# Altium schematic sheet CPU3.schdoc
size B; SheetNumber: 3; SheetTotal: 8
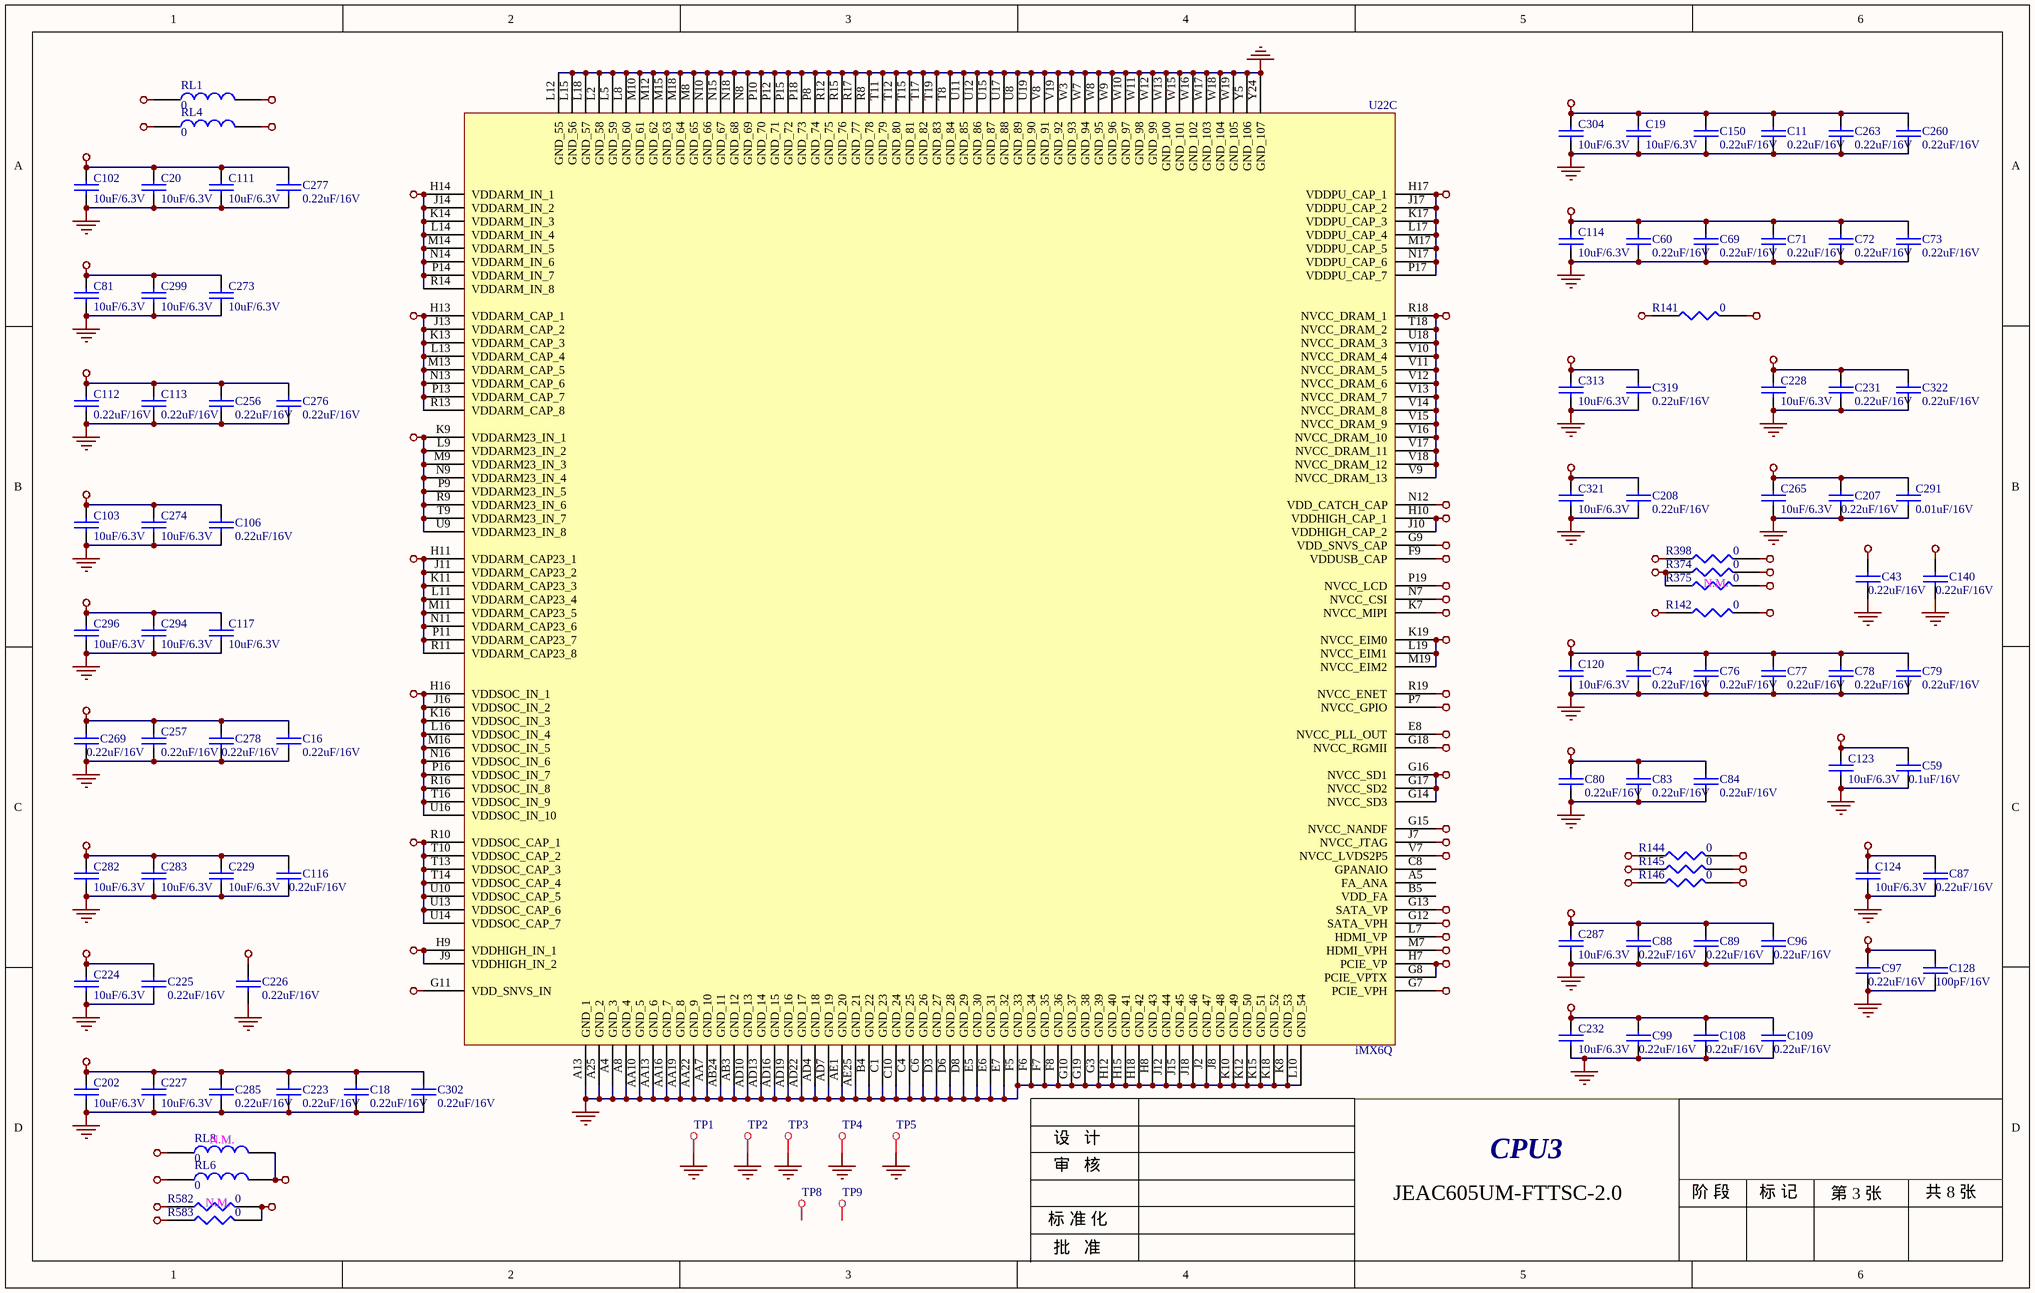
[diagram p0: CPU3.schdoc]

## Parts
C11  0.22uF/16V  [C0402]
C16  0.22uF/16V  [C0402]
C18  0.22uF/16V  [C0402]
C19  10uF/6.3V  [C0603]
C20  10uF/6.3V  [C0603]
C43  0.22uF/16V  [C0402]
C59  0.1uF/16V  [C0402]
C60  0.22uF/16V  [C0402]
C69  0.22uF/16V  [C0402]
C71  0.22uF/16V  [C0402]
C72  0.22uF/16V  [C0402]
C73  0.22uF/16V  [C0402]
C74  0.22uF/16V  [C0402]
C76  0.22uF/16V  [C0402]
C77  0.22uF/16V  [C0402]
C78  0.22uF/16V  [C0402]
C79  0.22uF/16V  [C0402]
C80  0.22uF/16V  [C0402]
C81  10uF/6.3V  [C0603]
C83  0.22uF/16V  [C0402]
C84  0.22uF/16V  [C0402]
C87  0.22uF/16V  [C0402]
C88  0.22uF/16V  [C0402]
C89  0.22uF/16V  [C0402]
C96  0.22uF/16V  [C0402]
C97  0.22uF/16V  [C0402]
C99  0.22uF/16V  [C0402]
C102  10uF/6.3V  [C0603]
C103  10uF/6.3V  [C0603]
C106  0.22uF/16V  [C0402]
C108  0.22uF/16V  [C0402]
C109  0.22uF/16V  [C0402]
C111  10uF/6.3V  [C0603]
C112  0.22uF/16V  [C0402]
C113  0.22uF/16V  [C0402]
C114  10uF/6.3V  [C0603]
C116  0.22uF/16V  [C0402]
C117  10uF/6.3V  [C0603]
C120  10uF/6.3V  [C0603]
C123  10uF/6.3V  [C0603]
C124  10uF/6.3V  [C0603]
C128  100pF/16V  [C0402]
C140  0.22uF/16V  [C0402]
C150  0.22uF/16V  [C0402]
C202  10uF/6.3V  [C0603]
C207  0.22uF/16V  [C0402]
C208  0.22uF/16V  [C0402]
C223  0.22uF/16V  [C0402]
C224  10uF/6.3V  [C0603]
C225  0.22uF/16V  [C0402]
C226  0.22uF/16V  [C0402]
C227  10uF/6.3V  [C0603]
C228  10uF/6.3V  [C0603]
C229  10uF/6.3V  [C0603]
C231  0.22uF/16V  [C0402]
C232  10uF/6.3V  [C0603]
C256  0.22uF/16V  [C0402]
C257  0.22uF/16V  [C0402]
C260  0.22uF/16V  [C0402]
C263  0.22uF/16V  [C0402]
C265  10uF/6.3V  [C0603]
C269  0.22uF/16V  [C0402]
C273  10uF/6.3V  [C0603]
C274  10uF/6.3V  [C0603]
C276  0.22uF/16V  [C0402]
C277  0.22uF/16V  [C0402]
C278  0.22uF/16V  [C0402]
C282  10uF/6.3V  [C0603]
C283  10uF/6.3V  [C0603]
C285  0.22uF/16V  [C0402]
C287  10uF/6.3V  [C0603]
C291  0.01uF/16V  [C0402]
C294  10uF/6.3V  [C0603]
C296  10uF/6.3V  [C0603]
C299  10uF/6.3V  [C0603]
C302  0.22uF/16V  [C0402]
C304  10uF/6.3V  [C0603]
C313  10uF/6.3V  [C0603]
C319  0.22uF/16V  [C0402]
C321  10uF/6.3V  [C0603]
C322  0.22uF/16V  [C0402]
R141  0  [R0402]
R142  0  [R0402]
R144  0  [R0402]
R145  0  [R0402]
R146  0  [R0402]
R374  0  [R0402]
R375  0  [R0402]
R398  0  [R0402]
R582  0  [R0402]
R583  0  [R0402]
RL1  0  [L0805]
RL4  0  [L0603]
RL6  0  [L0603]
RL8  0  [L0603]
TP1  Testpoint  [PC3_5D2_0]  (value not drawn)
TP2  Testpoint  [PC3_5D2_0]  (value not drawn)
TP3  Testpoint  [PC3_5D2_0]  (value not drawn)
TP4  Testpoint  [PC3_5D2_0]  (value not drawn)
TP5  Testpoint  [PC3_5D2_0]  (value not drawn)
TP8  Testpoint  [MTH059_06]  (value not drawn)
TP9  Testpoint  [MTH059_06]  (value not drawn)
U22  iMX6Q  [U-BGA-624-0_8]  (part C of 3)

## Nets
GND: C11.2 C16.2 C18.2 C19.2 C20.2 C43.2 C59.2 C60.2 C69.2 C71.2 C72.2 C73.2 C74.2 C76.2 C77.2 C78.2 C79.2 C80.2 C81.2 C83.2 C84.2 C87.2 C88.2 C89.2 C96.2 C97.2 C99.2 C102.2 C103.2 C106.2 C108.2 C109.2 C111.2 C112.2 C113.2 C114.2 C116.2 C117.2 C120.2 C123.2 C124.2 C128.2 C140.2 C150.2 C202.2 C207.2 C208.2 C223.2 C224.2 C225.2 C226.2 C227.2 C228.2 C229.2 C231.2 C232.2 C256.2 C257.2 C260.2 C263.2 C265.2 C269.2 C273.2 C274.2 C276.2 C277.2 C278.2 C282.2 C283.2 C285.2 C287.2 C291.2 C294.2 C296.2 C299.2 C302.2 C304.2 C313.2 C319.2 C321.2 C322.2 TP1.1(TP) TP2.1(TP) TP3.1(TP) TP4.1(TP) TP5.1(TP) U22.A4(GND_3) U22.A8(GND_4) U22.A13(GND_1) U22.A25(GND_2) U22.AA7(GND_10) U22.AA10(GND_5) U22.AA13(GND_6) U22.AA16(GND_7) U22.AA19(GND_8) U22.AA22(GND_9) U22.AB3(GND_12) U22.AB24(GND_11) U22.AD4(GND_18) U22.AD7(GND_19) U22.AD10(GND_13) U22.AD13(GND_14) U22.AD16(GND_15) U22.AD19(GND_16) U22.AD22(GND_17) U22.AE1(GND_20) U22.AE25(GND_21) U22.B4(GND_22) U22.C1(GND_23) U22.C4(GND_25) U22.C6(GND_26) U22.C10(GND_24) U22.D3(GND_27) U22.D6(GND_28) U22.D8(GND_29) U22.E5(GND_30) U22.E6(GND_31) U22.E7(GND_32) U22.F5(GND_33) U22.F6(GND_34) U22.F7(GND_35) U22.F8(GND_36) U22.G3(GND_39) U22.G10(GND_37) U22.G19(GND_38) U22.H8(GND_43) U22.H12(GND_40) U22.H15(GND_41) U22.H18(GND_42) U22.J2(GND_47) U22.J8(GND_48) U22.J12(GND_44) U22.J15(GND_45) U22.J18(GND_46) U22.K8(GND_53) U22.K10(GND_49) U22.K12(GND_50) U22.K15(GND_51) U22.K18(GND_52) U22.L2(GND_58) U22.L5(GND_59) U22.L8(GND_60) U22.L10(GND_54) U22.L12(GND_55) U22.L15(GND_56) U22.L18(GND_57) U22.M8(GND_65) U22.M10(GND_61) U22.M12(GND_62) U22.M15(GND_63) U22.M18(GND_64) U22.N8(GND_69) U22.N10(GND_66) U22.N15(GND_67) U22.N18(GND_68) U22.P8(GND_74) U22.P10(GND_70) U22.P12(GND_71) U22.P15(GND_72) U22.P18(GND_73) U22.R8(GND_78) U22.R12(GND_75) U22.R15(GND_76) U22.R17(GND_77) U22.T8(GND_84) U22.T11(GND_79) U22.T12(GND_80) U22.T15(GND_81) U22.T17(GND_82) U22.T19(GND_83) U22.U8(GND_89) U22.U11(GND_85) U22.U12(GND_86) U22.U15(GND_87) U22.U17(GND_88) U22.U19(GND_90) U22.V8(GND_91) U22.V19(GND_92) U22.W3(GND_93) U22.W7(GND_94) U22.W8(GND_95) U22.W9(GND_96) U22.W10(GND_97) U22.W11(GND_98) U22.W12(GND_99) U22.W13(GND_100) U22.W15(GND_101) U22.W16(GND_102) U22.W17(GND_103) U22.W18(GND_104) U22.W19(GND_105) U22.Y5(GND_106) U22.Y24(GND_107)
NVCC_PLL_OUT: C207.1 C265.1 C291.1 R142.1 U22.E8(NVCC_PLL_OUT)
VCC_1V1: R142.2
VCC_1V5: C87.1 C124.1 U22.G18(NVCC_RGMII)
VCC_2V8: R398.2
VCC_3V: C74.1 C76.1 C77.1 C78.1 C79.1 C80.1 C83.1 C84.1 C120.1 RL8.1 U22.G14(NVCC_SD3) U22.G15(NVCC_NANDF) U22.G16(NVCC_SD1) U22.G17(NVCC_SD2) U22.J7(NVCC_JTAG) U22.K19(NVCC_EIM0) U22.L19(NVCC_EIM1) U22.M19(NVCC_EIM2) U22.P7(NVCC_GPIO) U22.P19(NVCC_LCD) U22.R19(NVCC_ENET)
VCC_3V1: R582.1 RL6.1
VCC_CSI: C43.1 R398.1 U22.N7(NVCC_CSI)
VCC_MIPI: C140.1 R374.1 R375.1 U22.K7(NVCC_MIPI)
VCC_MIPIB: R375.2
VDD_ARM23_IN: C103.1 C106.1 C274.1 RL1.2 U22.K9(VDDARM23_IN_1) U22.L9(VDDARM23_IN_2) U22.M9(VDDARM23_IN_3) U22.N9(VDDARM23_IN_4) U22.P9(VDDARM23_IN_5) U22.R9(VDDARM23_IN_6) U22.T9(VDDARM23_IN_7) U22.U9(VDDARM23_IN_8)
VDD_ARM_CAP: C81.1 C112.1 C113.1 C256.1 C273.1 C276.1 C299.1 RL4.1 U22.H13(VDDARM_CAP_1) U22.J13(VDDARM_CAP_2) U22.K13(VDDARM_CAP_3) U22.L13(VDDARM_CAP_4) U22.M13(VDDARM_CAP_5) U22.N13(VDDARM_CAP_6) U22.P13(VDDARM_CAP_7) U22.R13(VDDARM_CAP_8)
VDD_ARM_CAP23: C16.1 C117.1 C257.1 C269.1 C278.1 C294.1 C296.1 RL4.2 U22.H11(VDDARM_CAP23_1) U22.J11(VDDARM_CAP23_2) U22.K11(VDDARM_CAP23_3) U22.L11(VDDARM_CAP23_4) U22.M11(VDDARM_CAP23_5) U22.N11(VDDARM_CAP23_6) U22.P11(VDDARM_CAP23_7) U22.R11(VDDARM_CAP23_8)
VDD_ARM_IN: C20.1 C102.1 C111.1 C277.1 RL1.1 U22.H14(VDDARM_IN_1) U22.J14(VDDARM_IN_2) U22.K14(VDDARM_IN_3) U22.L14(VDDARM_IN_4) U22.M14(VDDARM_IN_5) U22.N14(VDDARM_IN_6) U22.P14(VDDARM_IN_7) U22.R14(VDDARM_IN_8)
VDD_CACHE: C313.1 C319.1 R141.1 U22.N12(VDD_CATCH_CAP)
VDD_DRAM_1.2V: C60.1 C69.1 C71.1 C72.1 C73.1 C114.1 U22.R18(NVCC_DRAM_1) U22.T18(NVCC_DRAM_2) U22.U18(NVCC_DRAM_3) U22.V9(NVCC_DRAM_13) U22.V10(NVCC_DRAM_4) U22.V11(NVCC_DRAM_5) U22.V12(NVCC_DRAM_6) U22.V13(NVCC_DRAM_7) U22.V14(NVCC_DRAM_8) U22.V15(NVCC_DRAM_9) U22.V16(NVCC_DRAM_10) U22.V17(NVCC_DRAM_11) U22.V18(NVCC_DRAM_12)
VDD_HIGH: C228.1 C231.1 C322.1 R144.2 R146.2 R374.2 U22.H10(VDDHIGH_CAP_1) U22.J10(VDDHIGH_CAP_2)
VDD_LVDS2P5: C97.1 C128.1 R146.1 U22.V7(NVCC_LVDS2P5)
VDD_SNVS: C208.1 C321.1 U22.G9(VDD_SNVS_CAP)
VDD_SNVS_IN: C226.1 R582.2 R583.2 U22.G11(VDD_SNVS_IN)
VDD_SOC: C18.1 C202.1 C223.1 C227.1 C285.1 C302.1 R141.2 R145.2 U22.R10(VDDSOC_CAP_1) U22.T10(VDDSOC_CAP_2) U22.T13(VDDSOC_CAP_3) U22.T14(VDDSOC_CAP_4) U22.U10(VDDSOC_CAP_5) U22.U13(VDDSOC_CAP_6) U22.U14(VDDSOC_CAP_7)
VDD_SOC_IN: C116.1 C229.1 C282.1 C283.1 U22.H16(VDDSOC_IN_1) U22.J16(VDDSOC_IN_2) U22.K16(VDDSOC_IN_3) U22.L16(VDDSOC_IN_4) U22.M16(VDDSOC_IN_5) U22.N16(VDDSOC_IN_6) U22.P16(VDDSOC_IN_7) U22.R16(VDDSOC_IN_8) U22.T16(VDDSOC_IN_9) U22.U16(VDDSOC_IN_10)
VDD_SRTC_MX: R583.1
VDD_VP: C88.1 C89.1 C96.1 C287.1 R145.1 U22.G8(PCIE_VPTX) U22.G13(SATA_VP) U22.H7(PCIE_VP) U22.L7(HDMI_VP)
VDD_VPH: C99.1 C108.1 C109.1 C232.1 R144.1 U22.G7(PCIE_VPH) U22.G12(SATA_VPH) U22.M7(HDMI_VPH)
VDD_VPU: C11.1 C19.1 C150.1 C260.1 C263.1 C304.1 U22.H17(VDDPU_CAP_1) U22.J17(VDDPU_CAP_2) U22.K17(VDDPU_CAP_3) U22.L17(VDDPU_CAP_4) U22.M17(VDDPU_CAP_5) U22.N17(VDDPU_CAP_6) U22.P17(VDDPU_CAP_7)
VDDHIGH_IN: C224.1 C225.1 RL6.2 RL8.2 U22.H9(VDDHIGH_IN_1) U22.J9(VDDHIGH_IN_2)
VDDUSB_CAP: C59.1 C123.1 U22.F9(VDDUSB_CAP)

Not connected (* = marked no-connect by the designer): TP8 1(TP); TP9 1(TP); U22 A5(FA_ANA) B5(VDD_FA) C8(GPANAIO)

## Notes on the sheet
- (near R375) N.M.
- (near RL8) N.M.
- 设   计
- 审   核
- CPU3
- (near R582) N.M.
- 标 准 化
- JEAC605UM-FTTSC-2.0
- 阶 段
- 标 记
- 第 3 张
- 共 8 张
- 批   准

## Library data of the parts
C11 C16 C18-C20 C43 C59 C60 C69 C71-C74 C76-C81 C83 C84 C87-C89 C96 C97 C99 C102 C103 C106 C108 C109 C111-C114 C116 C117 C120 C123 C124 C128 C140 C150 C202 C207 C208 C223-C229 C231 C232 C256 C257 C260 C263 C265 C269 C273 C274 C276-C278 C282 C283 C285 C287 C291 C294 C296 C299 C302 C304 C313 C319 C321 C322 = CAP: Capacitor
R141 R142 R144-R146 R374 R375 R398 R582 R583 = RES1
RL1 RL4 RL6 RL8 = INDUCTOR
U22 = IMX6Q: pin to pad: A4>132 A5>U12 A8>133 A12>A10 A13>130 A14>A12 A15>F17 A16>83 A17>85 A19>91 A25>131 AA7>139 AA16>136 AA22>138 AA23>72 AA24>Y23 AA25>Y22 AB3>141 AB24>140 AB25>67 AC24>62 AC25>66 AD1>G23 AD2>H20 AD3>H22 AD4>147 AD5>E21 AD6>D23 AD7>148 AD8>T22 AD9>V23 AD10>142 AD11>AA22 AD12>L20 AD13>143 AD14>P22 AD15>K23 AD16>144 AD17>P19 AD18>H23 AD19>145 AD20>D23 AD21>54 AD22>146 AD23>T22 AD24>77 AD25>65 AE1>149 AE2>G21 AE3>H23 AE4>G22 AE5>D21 AE6>D22 AE7>D20 AE8>T23 AE9>Y20 AE10>W20 AE11>Y21 AE12>M21 AE13>N21 AE14>P23 AE15>K22 AE16>L18 AE17>M23 AE18>H22 AE19>46 AE20>D22 AE21>57 AE22>60 AE23>T23 AE24>61 AE25>150 B4>151 B5>170 B12>B10 B14>B12 B15>F16 B16>86 C1>152 C2>E15 C3>A8 C4>154 C6>155 C8>F9 C10>153 C12>94 C13>C20 C15>84 C16>84 C17>88 C25>U6 D3>156 D6>157 D8>158 D13>A21 D14>E16 D16>86 D17>90 D24>V1 D25>Y1 E5>159 E6>160 E7>161 E8>215 E13>E19 E14>A20 E15>85 E17>93 E20>C14 E22>Y3 E23>W2 E24>V5 E25>V4 F5>162 F6>163 F7>164 F12>B20 F15>83 F16>89 F23>Y4 F24>AA3 F25>Y5 G3>168 G5>C16 G6>W23 G10>166 G11>279 G14>H14 G15>209 G17>237 G19>167 G20>W1 G21>V2 G22>W3 G23>AA1 G24>V7 G25>W7 H5>73 H6>70 H8>172 H9>277 H10>296 H11>259 H12>169 H13>244 H16>267 H17>287 H18>171 H19>W6 H20>V3 H21>W5 H22>P18 H23>AA4 H24>W8 H25>G20 J4>D14 J5>F18 J7>298 J8>177 J9>278 J10>297 J11>260 J12>173 J13>245 J14>238 J15>174 J16>268 J17>288 J18>175 J19>AA2 J21>V6 J22>AB3 J23>Y7 J24>V8 J25>J21 K7>D13 K8>182 K9>251 K10>178 K11>261 K12>179 K13>246 K14>239 K15>180 K16>269 K17>289 K18>181 K19>258 K20>AB4 K22>AA6 K23>AB5 K24>W9 K25>R21 L7>M7 L8>189 L9>252 L10>183 L11>262 L13>247 L14>240 L15>185 L16>270 L17>290 L18>186 L19>U9 L20>R22 L21>AA7 L22>F23 L23>V9 L24>T21 L25>C23 M8>194 M9>253 M10>190 M11>263 M12>191 M13>248 M14>241 M15>192 M16>271 M17>291 M18>193 M19>U9 M20>E20 M21>W10 M22>U20 M23>C22 M24>V10 M25>AB9 N7>B19 N8>198 N9>254 N10>195 N11>264 N12>294 N13>249 N14>242 N15>196 N16>272 N17>292 N18>197 N19>R2 N20>C2 N21>E4 N22>W11 N23>W21 N24>R23 N25>D3 P7>165 P8>203 P9>255 P10>199 P11>265 P12>200 P13>250 P14>243 P15>201 P16>273 P17>293 P18>202 P19>J7 P20>R6 P22>J4 P23>N4 P24>J5 P25>D2 R1>A3 R2>C6 R3>A4 R4>A5 R5>B5 R6>D8 R8>207 R9>256 R10>280 R11>266 R12>204 R13>250 R14>243 R15>205 R16>274 R17>206 R18>28 R19>E7 R21>G3 R22>G6 R23>R3 R24>H6 R25>R1 T1>B21 T2>E8 T3>A19 T4>W22 T5>C8 T6>E5 T8>213 T9>257 T10>281 T11>208 T13>282 T14>283 T15>210 T16>275 T17>211 T18>29 T19>212 T20>C1 T21>D1 T22>F3 T23>H5 T24>N3 T25>E2 U1>AB14 U2>AC14 U3>AB13 U4>AC13 U5>F6 U6>D6 U8>218 U10>284 U13>285 U14>286 U15>216 U18>30 U19>219 U20>D17 U21>K20 U22>F4 U23>G5 U24>F5 U25>F2 V1>AB12 V2>AC12 V3>Y13 V4>AA13 V5>E6 V6>B3 V8>220 V9>40 V10>31 V11>32 V12>33 V13>34 V14>35 V15>36 V16>37 V17>38 V18>39 V19>221 V23>A21 V24>E3 V25>U1 W1>Y12 W2>AA12 W3>222 W4>D18 W5>B21 W6>C4 W7>223 W8>224 W9>225 W10>226 W11>227 W15>230 W16>231 W17>232 W18>233 W19>234 W20>B17 W21>D15 W22>C19 W23>F12 W24>C3 W25>74 Y5>235 Y20>55 Y21>78 Y24>236 Y25>69